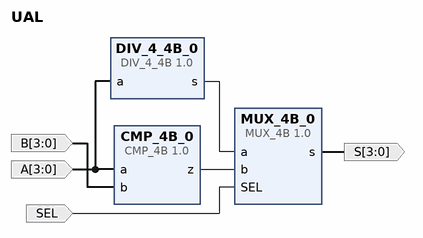
[diagram p0: block diagram of the top level]
# Vivado block design UAL, xc7a100tcsg324-1, Vivado 2020.1
create_bd_design UAL

create_bd_port -dir I -from 3 -to 0 A
create_bd_port -dir I -from 3 -to 0 B
create_bd_port -dir O -from 3 -to 0 S
create_bd_port -dir I SEL

create_bd_cell -type ip -vlnv xilinx.com:user:MUX_4B:1.0 MUX_4B_0
create_bd_cell -type ip -vlnv xilinx.com:user:DIV_4_4B:1.0 DIV_4_4B_0
create_bd_cell -type ip -vlnv xilinx.com:user:CMP_4B:1.0 CMP_4B_0

# ---- connections ----

connect_bd_net [get_bd_ports A] [get_bd_pins DIV_4_4B_0/a] [get_bd_pins CMP_4B_0/a]
connect_bd_net [get_bd_ports B] [get_bd_pins CMP_4B_0/b]
connect_bd_net [get_bd_pins DIV_4_4B_0/s] [get_bd_pins MUX_4B_0/a]
connect_bd_net [get_bd_pins CMP_4B_0/z] [get_bd_pins MUX_4B_0/b]
connect_bd_net [get_bd_pins MUX_4B_0/s] [get_bd_ports S]
connect_bd_net [get_bd_ports SEL] [get_bd_pins MUX_4B_0/SEL]

validate_bd_design
save_bd_design
